# Altium schematic sheet 10X SD CARD READER SCH SHEET 2.SchDoc
size A3
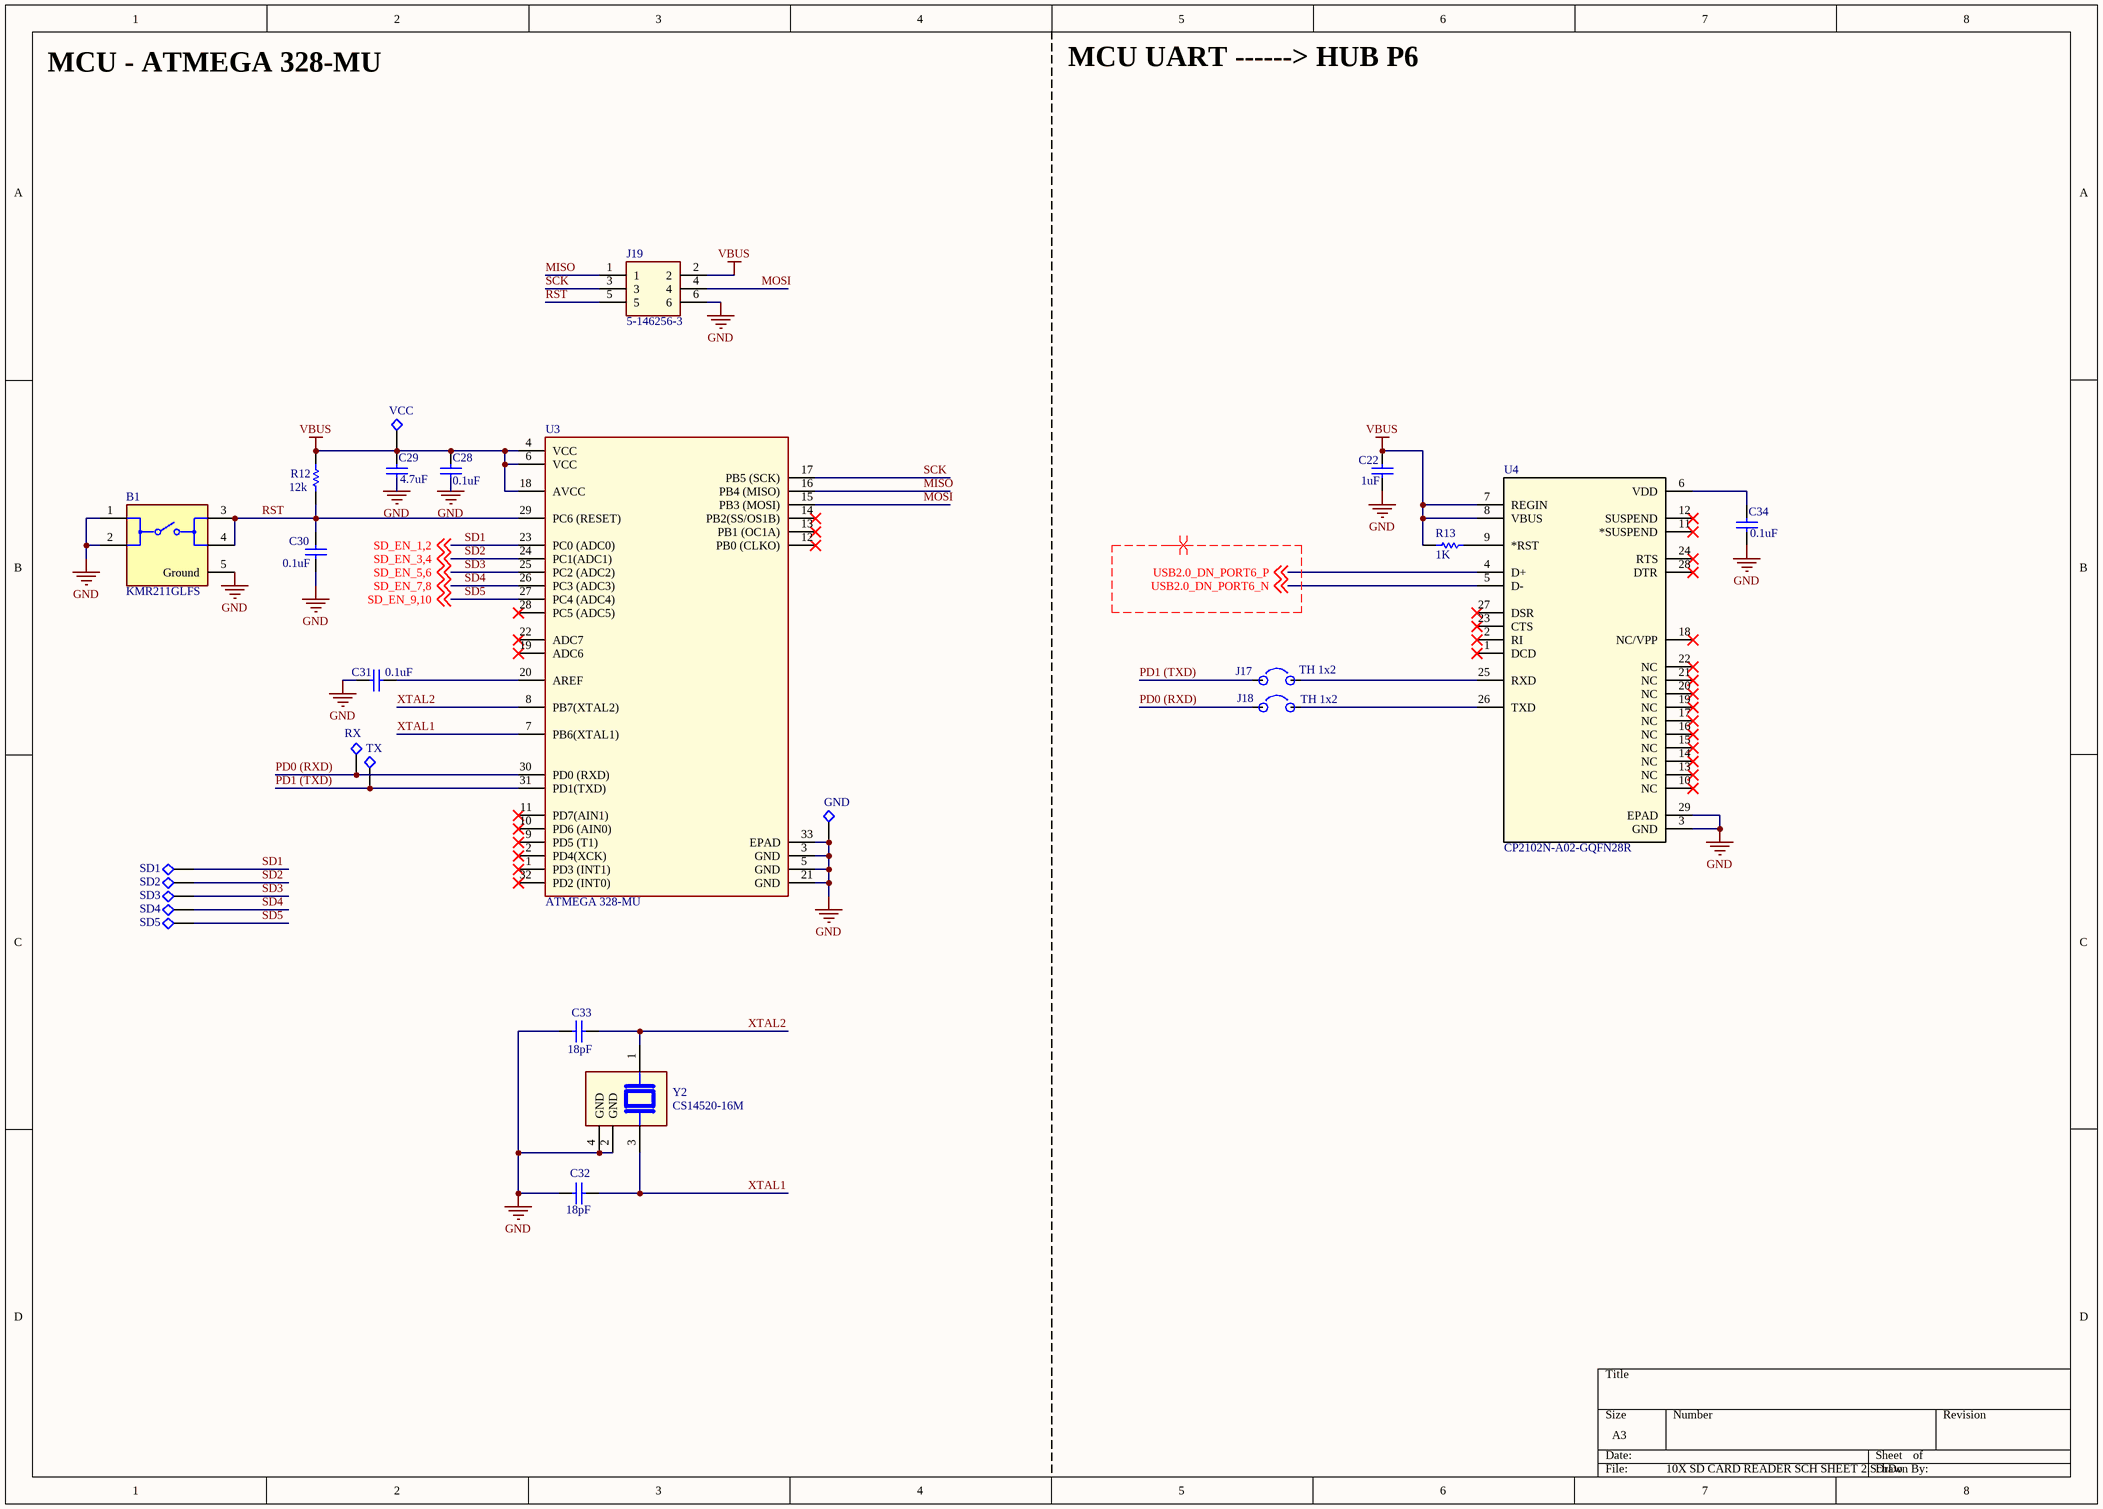
[diagram p0: 10X SD CARD READER SCH SHEET 2.SchDoc]

## Parts
B1  KMR211GLFS  [FP-KMR211GLFS-MFG]
C22  1uF  [C-0402/1005]
C28  0.1uF  [C-0402/1005]
C29  4.7uF  [0805-CAP]
C30  0.1uF  [C-0402/1005]
C31  0.1uF  [C-0402/1005]
C32  18pF  [C-0402/1005]
C33  18pF  [C-0402/1005]
C34  0.1uF  [C-0402/1005]
GND  Test Points  [Test Point TH Round H0.9,D1.6]  (value not drawn)
J17  TH 1x2  [PIN HEADER 1x2 2.54mm]
J18  TH 1x2  [PIN HEADER 1x2 2.54mm]
J19  5-146256-3  [TE_5-146256-3]
R12  12k  [R-0402/1005]
R13  1K  [R-0402/1005]
RX  Test Points  [Test Point TH Round H0.9,D1.6]  (value not drawn)
SD1  Test Points  [Test Point TH Round H0.9,D1.6]  (value not drawn)
SD2  Test Points  [Test Point TH Round H0.9,D1.6]  (value not drawn)
SD3  Test Points  [Test Point TH Round H0.9,D1.6]  (value not drawn)
SD4  Test Points  [Test Point TH Round H0.9,D1.6]  (value not drawn)
SD5  Test Points  [Test Point TH Round H0.9,D1.6]  (value not drawn)
TX  Test Points  [Test Point TH Round H0.9,D1.6]  (value not drawn)
U3  ATMEGA 328-MU  [ATMEGA 328P]
U4  CP2102N-A02-GQFN28R  [CP2102]
VCC  Test Points  [Test Point TH Round H0.9,D1.6]  (value not drawn)
Y2  CS14520-16M  [FL1600044]

## Nets
GND: B1.1 B1.2 B1.5(Ground) C22.2 C28.2 C29.2 C30.1 C31.1 C32.2 C33.2 C34.2 GND.1 J19.6 U3.3(GND) U3.5(GND) U3.21(GND) U3.33(EPAD) U4.3(GND) U4.29(EPAD) Y2.2(GND) Y2.4(GND)
VBUS: C22.1 C28.1 C29.1 J19.2 R12.1 R13.1 U3.4(VCC) U3.6(VCC) U3.18(AVCC) U4.7(REGIN) U4.8(VBUS) VCC.1
MISO: J19.1 U3.16(PB4_(MISO))
MOSI: J19.4 U3.15(PB3_(MOSI))
PD0 (RXD): J18.1 RX.1 U3.30(PD0_(RXD))
PD1 (TXD): J17.1 TX.1 U3.31(PD1(TXD))
RST: B1.3 B1.4 C30.2 J19.5 R12.2 U3.29(PC6_(RESET))
SCK: J19.3 U3.17(PB5_(SCK))
SD1: SD1.1 U3.23(PC0_(ADC0)) ; off-sheet SD_EN_1,2  [also labelled SD_EN_1,2]
SD2: SD2.1 U3.24(PC1(ADC1)) ; off-sheet SD_EN_3,4  [also labelled SD_EN_3,4]
SD3: SD3.1 U3.25(PC2_(ADC2)) ; off-sheet SD_EN_5,6  [also labelled SD_EN_5,6]
SD4: SD4.1 U3.26(PC3_(ADC3)) ; off-sheet SD_EN_7,8  [also labelled SD_EN_7,8]
SD5: SD5.1 U3.27(PC4_(ADC4)) ; off-sheet SD_EN_9,10  [also labelled SD_EN_9,10]
USB2.0_DN_PORT6_N: U4.5(D-) ; off-sheet USB2.0_DN_PORT6_N
USB2.0_DN_PORT6_P: U4.4(D+) ; off-sheet USB2.0_DN_PORT6_P
XTAL1: C32.1 U3.7(PB6(XTAL1)) Y2.3
XTAL2: C33.1 U3.8(PB7(XTAL2)) Y2.1
NetC31_2: C31.2 U3.20(AREF)
NetC34_1: C34.1 U4.6(VDD)
NetJ17_2: J17.2 U4.25(RXD)
NetJ18_2: J18.2 U4.26(TXD)
NetR13_2: R13.2 U4.9(*RST)

Not connected (* = marked no-connect by the designer): U3 1(PD3_(INT1))* 2(PD4(XCK))* 9(PD5_(T1))* 10(PD6_(AIN0))* 11(PD7(AIN1))* 12(PB0_(CLKO))* 13(PB1_(OC1A))* 14(PB2(SS/OS1B))* 19(ADC6)* 22(ADC7)* 28(PC5_(ADC5))* 32(PD2_(INT0))*; U4 1(DCD)* 2(RI)* 10(NC)* 11(*SUSPEND)* 12(SUSPEND)* 13(NC)* 14(NC)* 15(NC)* 16(NC)* 17(NC)* 18(NC/VPP)* 19(NC)* 20(NC)* 21(NC)* 22(NC)* 23(CTS)* 24(RTS)* 27(DSR)* 28(DTR)*

## Layout directives
differential pair; differential pair class Diff_90R: USB2.0_DN_PORT6_N, USB2.0_DN_PORT6_P

## Notes on the sheet
- MCU - ATMEGA 328-MU
- MCU UART ------> HUB P6

## Library data of the parts
B1 = CMP-10040-000023-1: SWITCH TACTILE SPST-NO 0.05A 32V; Switch Function: Off-Mom; Throw Configuration: SPST; Switch Travel: 0.2mm; Current Rating: 50mA; Illumination Type: Non-Illuminated; Actuator Length: 0.5mm; Power Rating: 1W; Operating Force: 1.2N; Actuator Type: Standard; Mechanical Life: 200000Cycles; REACH SVHC: No SVHC; Voltage Rating (DC): 32V; Length: 2.8mm; Min Operating Temperature: -40°C; Mount: Surface Mount; Max Voltage Rating (DC): 32V; Width: 2.8mm; Depth: 4.6mm; Packaging: Tape and Reel; Lead Free: Lead Free; Contact Material: Silver; Termination: Gull Wing; Package Quantity: 1; Contact Current Rating: 50mA; Orientation: Straight; Max Operating Temperature: 85°C; Radiation Hardening: No; Max Current Rating: 50mA; Contact Plating: Silver
C22 C34 = Cap: Capacitor; Value: 4.7uF; Published: 8-Jun-2000; LatestRevisionDate: 17-Jul-2002; LatestRevisionNote: Re-released for DXP Platform.; PackageReference: RAD-0.3; Publisher: Altium Limited; PackageDescription: Radial Cap, Thru-Hole; 2 Leads; 0.3 in Pin Spacing
C28 = Cap: Capacitor; Value: 100nF; Published: 8-Jun-2000; LatestRevisionDate: 17-Jul-2002; LatestRevisionNote: Re-released for DXP Platform.; PackageReference: RAD-0.3; Publisher: Altium Limited; PackageDescription: Radial Cap, Thru-Hole; 2 Leads; 0.3 in Pin Spacing
C29-C31 = Cap: Capacitor; Published: 8-Jun-2000; LatestRevisionDate: 17-Jul-2002; LatestRevisionNote: Re-released for DXP Platform.; PackageReference: RAD-0.3; Publisher: Altium Limited; PackageDescription: Radial Cap, Thru-Hole; 2 Leads; 0.3 in Pin Spacing
  C29: Value: 4.7uF
  C30 C31: Value: 0.1uF
C32 C33 = Cap: Capacitor; Value: 0.1uF; Published: 8-Jun-2000; LatestRevisionDate: 17-Jul-2002; LatestRevisionNote: Re-released for DXP Platform.; PackageReference: RAD-0.3; Publisher: Altium Limited; PackageDescription: Radial Cap, Thru-Hole; 2 Leads; 0.3 in Pin Spacing
J17 J18 = Jumper 2 pin: CONN HEADER VERT 3POS 2.54MM; Mfr. Part No.: 75160-156-03LF; Value: 51R; Unit Price (USD): 0.74; Supplier Part No.: 609-75160-156-03LF-ND; Supplier: Digikey Electronics
J19 = 5-146256-3: Header; Breakaway; 0.100 x 0.100 in.; PC Board; Dual; 6; 0.025 in.; 0.12 in.; Centerline_Pitch: 2.54 mm[.1 in]; Number_of_Positions: 6; MF: TE Connectivity; Product_Type: Connector; TE_purchase_URL: https://www.te.com/usa-en/product-5-146256-3.html?te_bu=Cor&te_type=disp&te_campaign=seda_glo_cor-seda-global-disp-prtnr-fy19-seda-model-bom-cta_sma-317_1&elqCampaignId=32493; SnapEDA_Link: https://www.snapeda.com/parts/5-146256-3/TE%20Connectivity/view-part/486039/?ref=snap; EU_RoHS_Compliance: Compliant; MP: 5-146256-3; Value: *; Package: None; Digi-Key_Part_Number: A121369-ND; Digi-Key_Purchase_URL: https://www.digikey.com/product-detail/en/te-connectivity-amp-connectors/5-146256-3/A121369-ND/1153559?utm_source=snapeda&utm_medium=aggregator&utm_campaign=symbol
R12 R13 = Res1: Resistor; Value: 100K; Published: 8-Jun-2000; LatestRevisionDate: 17-Jul-2002; LatestRevisionNote: Re-released for DXP Platform.; PackageReference: AXIAL-0.3; Publisher: Altium Limited; PackageDescription: Axial Device, Thru-Hole; 2 Leads; 0.3 in Pin Spacing
U3 = ATMEGA 328-MU: IC MCU 8BIT 32KB FLASH 32VQFN; Manufacturer: Microchip Technology; Manufacturer Product Number: ATMEGA328P-MU; Digi-Key Part Number: ATMEGA328P-MU-ND; Unit Price: $ 2.42; Stock: 6187
U4 = CP2102: USB Bridge, USB to UART USB 2.0 UART Interface; Manufacturer: Silicon Labs; Manufacturer Product Number: CP2102N-A02-GQFN28R; Digi-Key Part Number: 336-5890-2-ND; Unit Price: $4.66; Stock: 45696
Y2 = FL1600044